# EAGLE design CrackberryPi_1.0.6.2_ir (EAGLE 7.2.0)
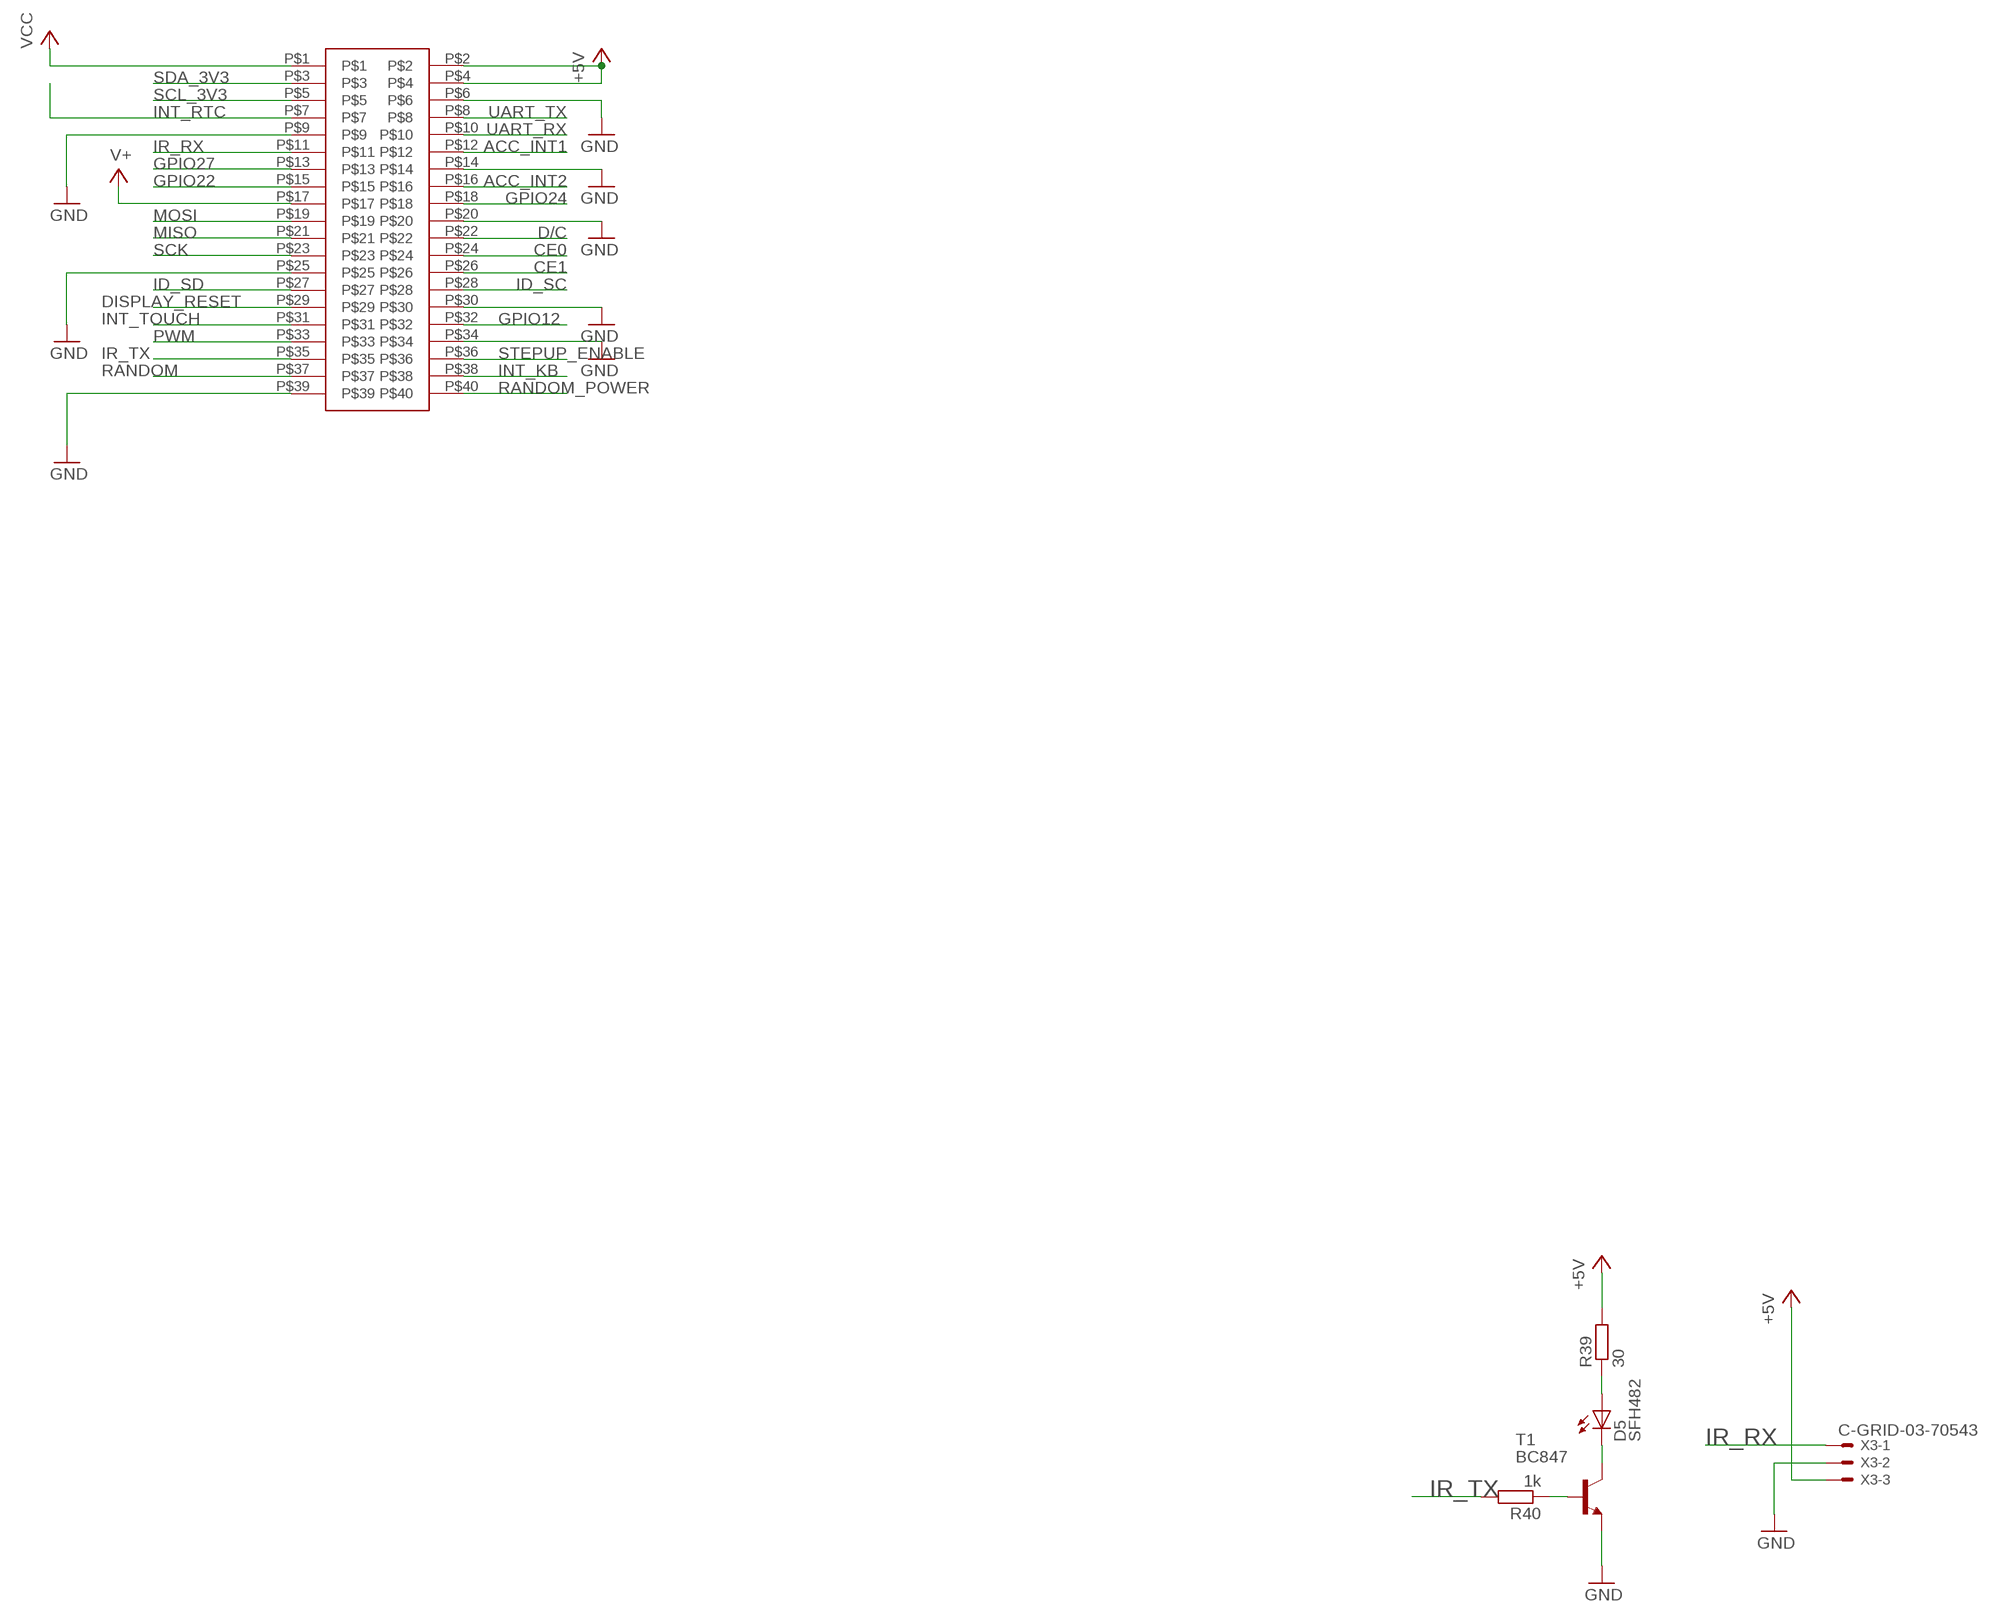
[diagram p0: schematic, sheet 1]

## Parts
D5  SFH482  [SFH482]
R39  30  R-EU_R0603  [R0603]
R40  1k  R-EU_R0603  [R0603]
T1  BC847  [SOT23]
U$11  HEADER  [20X2]
X3  C-GRID-03-70543  [70543-03]

## Nets
+5V: R39.2 U$11.P$2 U$11.P$4 X3.3
ACC_INT1: U$11.P$12
ACC_INT2: U$11.P$16
BASE: R40.1 T1.1(B)
CE0: U$11.P$24
CE1: U$11.P$26
COLLECTOR: D5.K(C) T1.3(C)
D/C: U$11.P$22
DISPLAY_RESET: U$11.P$29
GND: T1.2(E) U$11.P$6 U$11.P$9 U$11.P$14 U$11.P$20 U$11.P$25 U$11.P$30 U$11.P$34 U$11.P$39 X3.2
GPIO12: U$11.P$32
GPIO22: U$11.P$15
GPIO24: U$11.P$18
GPIO27: U$11.P$13
ID_SC: U$11.P$28
ID_SD: U$11.P$27
INT_KB: U$11.P$38
INT_RTC: U$11.P$7
INT_TOUCH: U$11.P$31
IR_RX: U$11.P$11 X3.1
IR_TX: R40.2 U$11.P$35
MISO: U$11.P$21
MOSI: U$11.P$19
N$30: D5.A R39.1
PWM: U$11.P$33
RANDOM: U$11.P$37
RANDOM_POWER: U$11.P$40
SCK: U$11.P$23
SCL_3V3: U$11.P$5
SDA_3V3: U$11.P$3
STEPUP_ENABLE: U$11.P$36
UART_RX: U$11.P$10
UART_TX: U$11.P$8
V+: U$11.P$17
VCC: U$11.P$1

## Library data of the parts
D5 = led:SFH482: IR LED infrared emitting diode, Infineon
R39 R40 = rcl:R-EU_: RESISTOR, European symbol
T1 = transistor:BC847: NPN TRANSISTOR
U$11 = 20x2_cirqoid:HEADER
X3 = con-molex:C-GRID-03: CONNECTOR wire to board 2.54 mm (0.100") pitch header; OC_FARNELL: unknown; OC_NEWARK: unknown

## Board
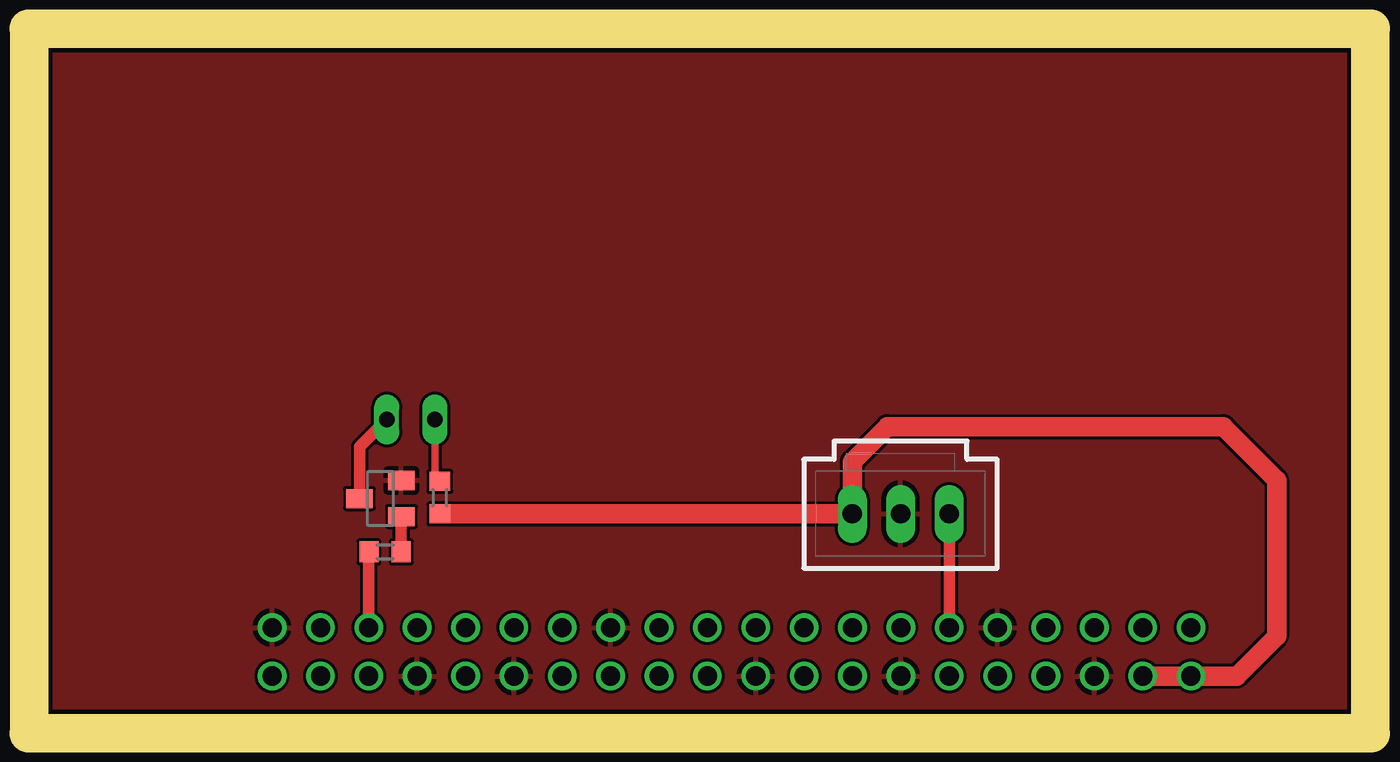
[diagram p1: board, top side]
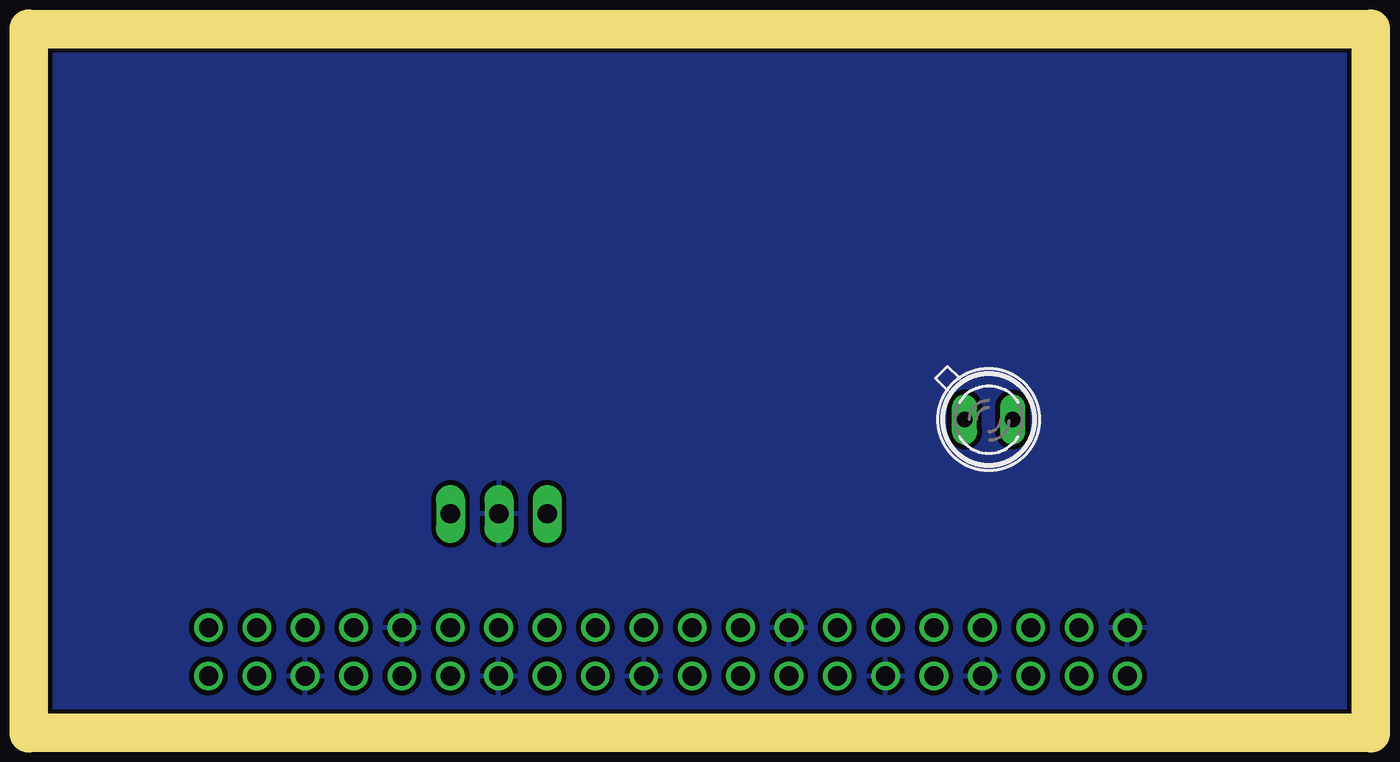
[diagram p2: board, bottom side, seen from below]

Size 68.5 x 35 mm. Coordinates in mm from the lower left corner, seen from the top.
Outline: 68.5,0 68.5,35 0,35 0,0 68.5,0
Copper layers (1*16): Top 0.035mm / dielectric 1.5mm / Bottom 0.035mm
Design rules "SeeedStudio_2layer_DRU_no_angle_20140221": minimum track width 6mil, minimum drill 12mil, track to track 6mil, track to pad 6mil, pad to pad 6mil, via to via 6mil, smd to smd 0mil, copper to edge 10mil, drill to drill 10mil, minimum pad ring 10mil, minimum via ring 6mil, stop-mask expansion 2mil, vias tented up to drill 100mil, thermal gap 10mil
Milling: 4 lines

### Footprints (pad centres in the part's own frame; a part is rotated, then mirrored left to right if it is on the bottom)
SFH482 = drill 0.813 long: A -1.27,0; K 1.27,0
R0603 = smd 1 x 1.1: 1 -0.85,0; 2 0.85,0
SOT23 = smd 1 x 1.4: 1 -0.95,-1.1; 2 0.95,-1.1; 3 0,1.1
20X2 = drill 1: P$1 0,0; P$2 0,2.54; P$3 2.54,0; P$4 2.54,2.54; P$5 5.08,0; P$6 5.08,2.54; P$7 7.62,0; P$8 7.62,2.54; P$9 10.16,0; P$10 10.16,2.54; P$11 12.7,0; P$12 12.7,2.54; P$13 15.24,0; P$14 15.24,2.54; P$15 17.78,0; P$16 17.78,2.54; P$17 20.32,0; P$18 20.32,2.54; P$19 22.86,0; P$20 22.86,2.54; P$21 25.4,0; P$22 25.4,2.54; P$23 27.94,0; P$24 27.94,2.54; P$25 30.48,0; P$26 30.48,2.54; P$27 33.02,0; P$28 33.02,2.54; P$29 35.56,0; P$30 35.56,2.54; P$31 38.1,0; P$32 38.1,2.54; P$33 40.64,0; P$34 40.64,2.54; P$35 43.18,0; P$36 43.18,2.54; P$37 45.72,0; P$38 45.72,2.54; P$39 48.26,0; P$40 48.26,2.54
70543-03 = drill 1.016 long: 1 -2.54,0; 2 0,0; 3 2.54,0

### Placement (x,y rotation side)
D5  19.07,15.47 0 bottom
R39  20.6,11.38 270 top
R40  17.73,8.53 180 top
T1  17.48,11.32 90 top
U$11  60.05,4.55 180 top
X3  44.8,10.53 180 top

### Tracks (layer width: path | path; a pad name or v marks a point on that pad's centre or on a via)
+5V
  Top 1.016: U$11.P$4 U$11.P$2 62.46,2.01 64.55,4.1 64.55,12.3 61.75,15.1 44.1,15.1 42.26,13.26 X3.3 R39.2
BASE
  Top 0.61: T1.1 R40.1
COLLECTOR
  Top 0.61: T1.3 16.38,14.04 D5.K
GND
  pour Bottom (isolate 0.254, rank 6): 68.65,0 68.65,35 0,35 0,0
  pour Top (rank 6): 68.62,0 68.62,35 0,35 0,0
IR_RX
  Top 0.61: X3.1 47.35,10.52 U$11.P$11
IR_TX
  Top 0.61: R40.2 U$11.P$35
N$30
  Top 0.406: R39.1 20.34,12.48 D5.A